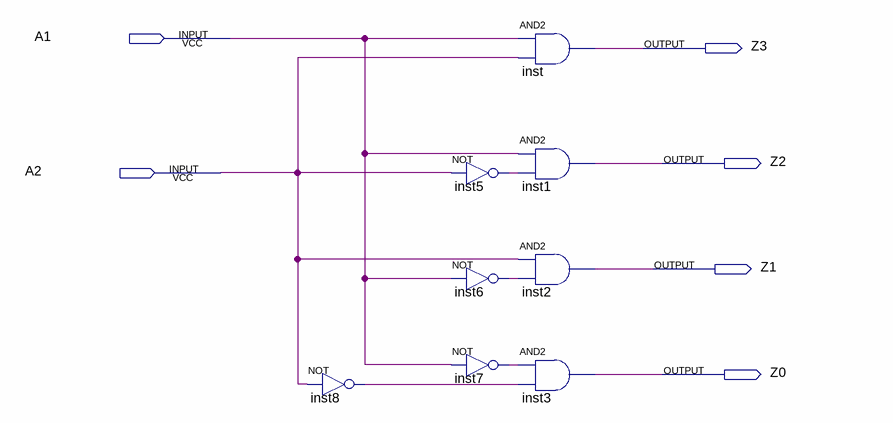
[diagram p0: schematic sheet]
// Quartus schematic 2-4.bdf as structural Verilog: 8 symbols, 6 pins
module \2-4  (
  input  A1,
  input  A2,
  output Z3,
  output Z2,
  output Z1,
  output Z0
);

  wire inst5_out, inst6_out, inst7_out, inst8_out;

  not inst8 (inst8_out, A2);
  not inst5 (inst5_out, A2);
  not inst6 (inst6_out, A1);
  not inst7 (inst7_out, A1);
  and inst (Z3, A1, A2);
  and inst1 (Z2, A1, inst5_out);
  and inst2 (Z1, A2, inst6_out);
  and inst3 (Z0, inst7_out, inst8_out);
endmodule
